# Altium project FDC.PrjPcb
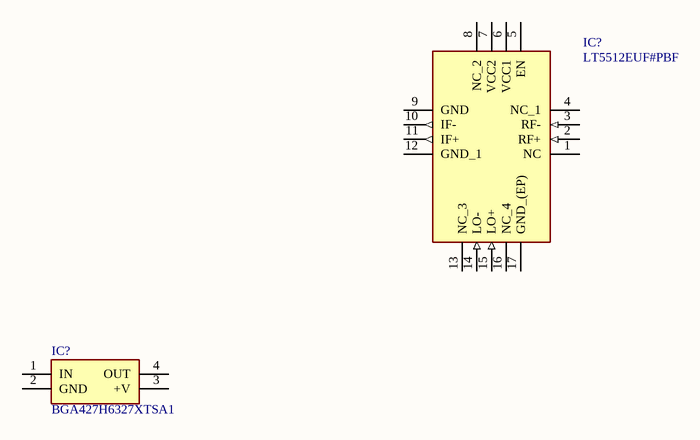
[diagram p0: LT5512.SchDoc]
1 sheet, 2 parts. Net scope: global (net labels, ports and power ports of the same name join across sheets).

## Sheet LT5512.SchDoc
size A4

### Parts
(Parts that share a designator on the sheet are numbered #1, #2 ... from top to bottom, then left to right.)
IC?#1  LT5512EUF#PBF  [QFN65P400X400X80-17N-D]
IC?#2  BGA427H6327XTSA1  [SOT343]

### Nets

Not connected (* = marked no-connect by the designer): IC?#1 1(NC) 2(RF+) 3(RF-) 4(NC_1) 5(EN) 6(VCC1) 7(VCC2) 8(NC_2) 9(GND) 10(IF-) 11(IF+) 12(GND_1) 13(NC_3) 14(LO-) 15(LO+) 16(NC_4) 17(GND_(EP)); IC?#2 1(IN) 2(GND) 3(+V) 4(OUT)

### Library data of the parts
IC?#1 = LT5512EUF#PBF: Integrated Circuit; Manufacturer_Name: Linear Technology; Datasheet Link: http://cds.linear.com/docs/en/datasheet/5512fa.pdf; Height: 0.8mm; Manufacturer_Part_Number: LT5512EUF#PBF; RS Part Number: 5060861P; RS Price/Stock: http://uk.rs-online.com/web/p/products/5060861P
IC?#2 = BGA427H6327XTSA1: Integrated Circuit; Manufacturer_Name: Infineon; Datasheet Link: https://www.infineon.com/dgdl/Infineon-BGA427-DS-v01_01-en.pdf?fileId=db3a304314dca3890115418dca4d1638; Manufacturer_Part_Number: BGA427H6327XTSA1; Mouser Part Number: 726-BGA427H6327XTSA1; Mouser Price/Stock: https://www.mouser.com/Search/Refine.aspx?Keyword=726-BGA427H6327XTSA1; RS Part Number: 8977416P; RS Price/Stock: http://uk.rs-online.com/web/p/products/8977416P